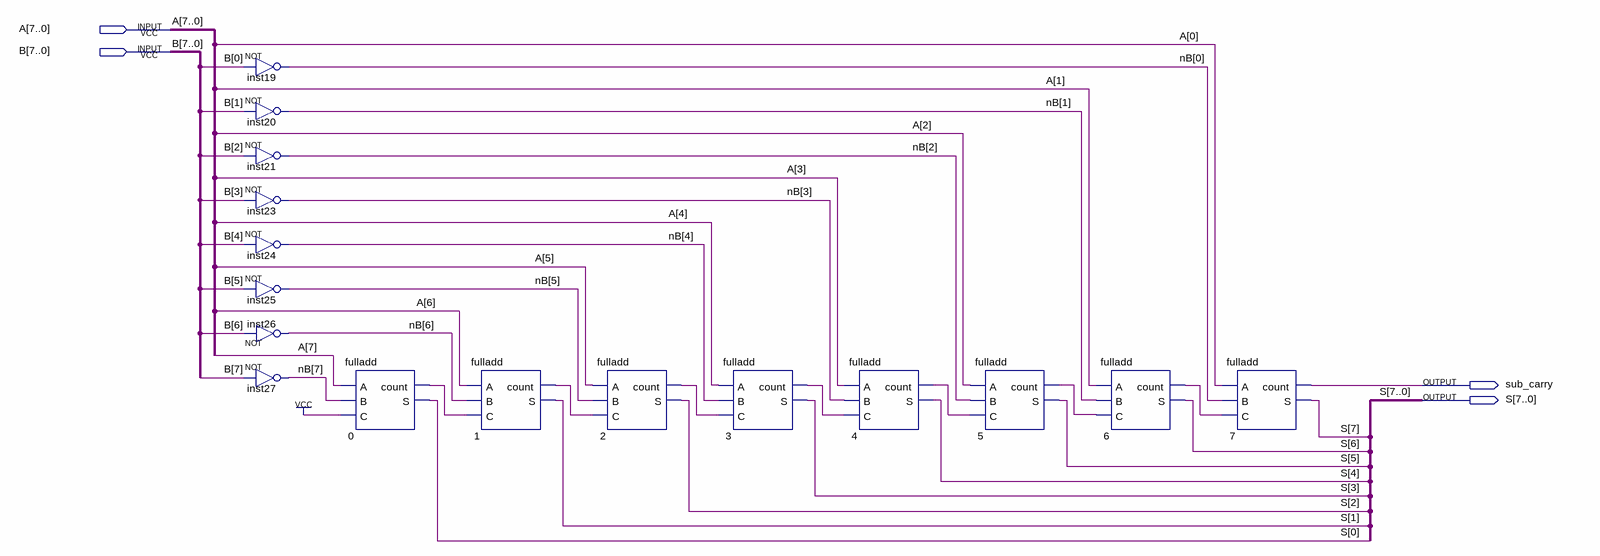
[diagram p0: schematic sheet]
// Quartus schematic CMP.bdf as structural Verilog: 16 symbols, 4 pins
module CMP (
  input  [7:0] A,
  input  [7:0] B,
  output sub_carry,
  output [7:0] S
);

  wire n0_count, n1_count, n2_count, n3_count, n4_count, n5_count, n6_count;
  wire [7:0] nB;

  not inst19 (nB[0], B[0]);
  not inst20 (nB[1], B[1]);
  not inst21 (nB[2], B[2]);
  not inst23 (nB[3], B[3]);
  not inst24 (nB[4], B[4]);
  not inst25 (nB[5], B[5]);
  not inst26 (nB[6], B[6]);
  not inst27 (nB[7], B[7]);
  fulladd u_0 (.A(A[7]), .B(nB[7]), .C(1'b1), .count(n0_count), .S(S[0]));
  fulladd u_1 (.A(A[6]), .B(nB[6]), .C(n0_count), .count(n1_count), .S(S[1]));
  fulladd u_2 (.A(A[5]), .B(nB[5]), .C(n1_count), .count(n2_count), .S(S[2]));
  fulladd u_3 (.A(A[4]), .B(nB[4]), .C(n2_count), .count(n3_count), .S(S[3]));
  fulladd u_4 (.A(A[3]), .B(nB[3]), .C(n3_count), .count(n4_count), .S(S[4]));
  fulladd u_5 (.A(A[2]), .B(nB[2]), .C(n4_count), .count(n5_count), .S(S[5]));
  fulladd u_6 (.A(A[1]), .B(nB[1]), .C(n5_count), .count(n6_count), .S(S[6]));
  fulladd u_7 (.A(A[0]), .B(nB[0]), .C(n6_count), .count(sub_carry), .S(S[7]));
endmodule
